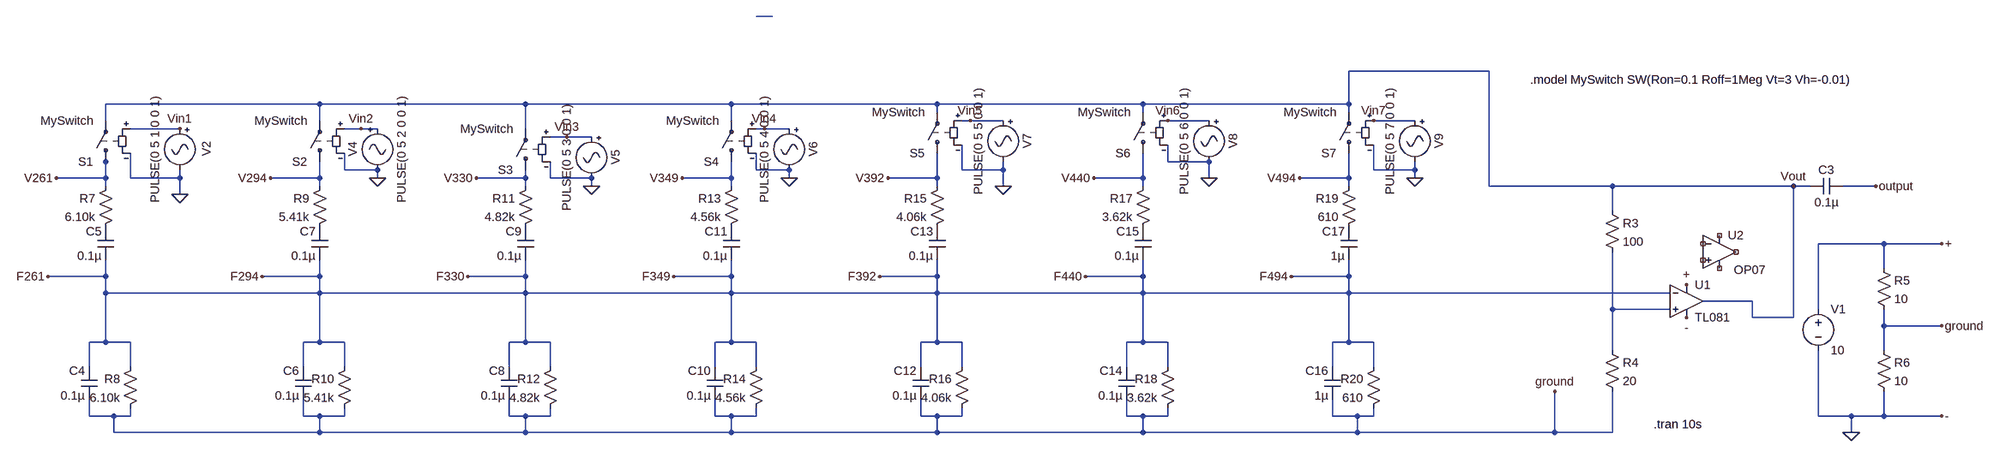
[diagram p0: schematic Sine_wave_oscilator_SW.asc]
Sine_wave_oscilator_SW.asc, the LTspice schematic file:
Version 4
SHEET 1 1532 724
WIRE -1376 -272 -1408 -272
WIRE 16 -160 -256 -160
WIRE -2256 -96 -2672 -96
WIRE -1856 -96 -2256 -96
WIRE -1456 -96 -1856 -96
WIRE -1056 -96 -1456 -96
WIRE -656 -96 -1056 -96
WIRE -256 -96 -256 -160
WIRE -256 -96 -656 -96
WIRE -1056 -80 -1056 -96
WIRE -656 -80 -656 -96
WIRE -256 -80 -256 -96
WIRE -2672 -64 -2672 -96
WIRE -2256 -64 -2256 -96
WIRE -1456 -64 -1456 -96
WIRE -992 -64 -1008 -64
WIRE -928 -64 -992 -64
WIRE -528 -64 -608 -64
WIRE -128 -64 -208 -64
WIRE -2528 -48 -2624 -48
WIRE -2176 -48 -2208 -48
WIRE -2144 -48 -2176 -48
WIRE -1856 -48 -1856 -96
WIRE -1392 -48 -1408 -48
WIRE -1344 -48 -1392 -48
WIRE -1776 -32 -1808 -32
WIRE -1728 -32 -1776 -32
WIRE -2672 16 -2672 0
WIRE -608 16 -608 -16
WIRE -528 16 -608 16
WIRE -2208 32 -2208 0
WIRE -2144 32 -2208 32
WIRE -1408 32 -1408 0
WIRE -1344 32 -1408 32
WIRE -1008 32 -1008 -16
WIRE -928 32 -928 16
WIRE -928 32 -1008 32
WIRE -208 32 -208 -16
WIRE -128 32 -128 16
WIRE -128 32 -208 32
WIRE -2672 48 -2672 16
WIRE -2672 48 -2768 48
WIRE -2624 48 -2624 0
WIRE -2528 48 -2528 32
WIRE -2528 48 -2624 48
WIRE -2256 48 -2256 16
WIRE -2256 48 -2352 48
WIRE -2144 48 -2144 32
WIRE -1856 48 -1856 32
WIRE -1856 48 -1952 48
WIRE -1808 48 -1808 16
WIRE -1728 48 -1808 48
WIRE -1456 48 -1456 16
WIRE -1456 48 -1552 48
WIRE -1344 48 -1344 32
WIRE -1056 48 -1056 0
WIRE -1056 48 -1152 48
WIRE -656 48 -656 0
WIRE -656 48 -752 48
WIRE -528 48 -528 16
WIRE -256 48 -256 0
WIRE -256 48 -352 48
WIRE -128 48 -128 32
WIRE -2672 64 -2672 48
WIRE -2256 64 -2256 48
WIRE -1856 64 -1856 48
WIRE -1728 64 -1728 48
WIRE -1456 64 -1456 48
WIRE -1056 64 -1056 48
WIRE -928 64 -928 32
WIRE -656 64 -656 48
WIRE -256 64 -256 48
WIRE 16 64 16 -160
WIRE 256 64 16 64
WIRE 608 64 256 64
WIRE 640 64 608 64
WIRE 768 64 704 64
WIRE -2528 80 -2528 48
WIRE 256 112 256 64
WIRE 784 176 656 176
WIRE 896 176 784 176
WIRE 784 224 784 176
WIRE -2672 240 -2672 208
WIRE -2672 240 -2784 240
WIRE -2256 240 -2256 208
WIRE -2256 240 -2368 240
WIRE -1856 240 -1856 208
WIRE -1856 240 -1968 240
WIRE -1456 240 -1456 208
WIRE -1456 240 -1568 240
WIRE -1056 240 -1056 208
WIRE -1056 240 -1168 240
WIRE -656 240 -656 208
WIRE -656 240 -768 240
WIRE -256 240 -256 208
WIRE -256 240 -368 240
WIRE -2672 272 -2672 240
WIRE -2256 272 -2256 240
WIRE -2256 272 -2672 272
WIRE -1856 272 -1856 240
WIRE -1856 272 -2256 272
WIRE -1456 272 -1456 240
WIRE -1456 272 -1856 272
WIRE -1056 272 -1056 240
WIRE -1056 272 -1456 272
WIRE -656 272 -656 240
WIRE -656 272 -1056 272
WIRE -256 272 -256 240
WIRE -256 272 -656 272
WIRE 368 272 -256 272
WIRE 528 288 432 288
WIRE 256 304 256 192
WIRE 368 304 256 304
WIRE 656 304 656 176
WIRE 528 320 528 288
WIRE 608 320 608 64
WIRE 608 320 528 320
WIRE 784 336 784 304
WIRE 896 336 784 336
WIRE -2672 368 -2672 272
WIRE -2672 368 -2704 368
WIRE -2624 368 -2672 368
WIRE -2256 368 -2256 272
WIRE -2256 368 -2288 368
WIRE -2208 368 -2256 368
WIRE -1856 368 -1856 272
WIRE -1856 368 -1888 368
WIRE -1808 368 -1856 368
WIRE -1456 368 -1456 272
WIRE -1456 368 -1488 368
WIRE -1408 368 -1456 368
WIRE -1056 368 -1056 272
WIRE -1056 368 -1088 368
WIRE -1008 368 -1056 368
WIRE -656 368 -656 272
WIRE -656 368 -688 368
WIRE -608 368 -656 368
WIRE -256 368 -256 272
WIRE -256 368 -288 368
WIRE -208 368 -256 368
WIRE 256 384 256 304
WIRE 784 384 784 336
WIRE -2704 416 -2704 368
WIRE -2624 416 -2624 368
WIRE -2288 416 -2288 368
WIRE -2208 416 -2208 368
WIRE -1888 416 -1888 368
WIRE -1808 416 -1808 368
WIRE -1488 416 -1488 368
WIRE -1408 416 -1408 368
WIRE -1088 416 -1088 368
WIRE -1008 416 -1008 368
WIRE -688 416 -688 368
WIRE -608 416 -608 368
WIRE -288 416 -288 368
WIRE -208 416 -208 368
WIRE -2704 512 -2704 480
WIRE -2656 512 -2704 512
WIRE -2624 512 -2624 496
WIRE -2624 512 -2656 512
WIRE -2288 512 -2288 480
WIRE -2256 512 -2288 512
WIRE -2208 512 -2208 496
WIRE -2208 512 -2256 512
WIRE -1888 512 -1888 480
WIRE -1856 512 -1888 512
WIRE -1808 512 -1808 496
WIRE -1808 512 -1856 512
WIRE -1488 512 -1488 480
WIRE -1456 512 -1488 512
WIRE -1408 512 -1408 496
WIRE -1408 512 -1456 512
WIRE -1088 512 -1088 480
WIRE -1056 512 -1088 512
WIRE -1008 512 -1008 496
WIRE -1008 512 -1056 512
WIRE -688 512 -688 480
WIRE -656 512 -688 512
WIRE -608 512 -608 496
WIRE -608 512 -656 512
WIRE -288 512 -288 480
WIRE -240 512 -288 512
WIRE -208 512 -208 496
WIRE -208 512 -240 512
WIRE 656 512 656 384
WIRE 720 512 656 512
WIRE 784 512 784 464
WIRE 784 512 720 512
WIRE 896 512 784 512
WIRE -2656 544 -2656 512
WIRE -2256 544 -2256 512
WIRE -2256 544 -2656 544
WIRE -1856 544 -1856 512
WIRE -1856 544 -2256 544
WIRE -1456 544 -1456 512
WIRE -1456 544 -1856 544
WIRE -1056 544 -1056 512
WIRE -1056 544 -1456 544
WIRE -656 544 -656 512
WIRE -656 544 -1056 544
WIRE -240 544 -240 512
WIRE -240 544 -656 544
WIRE 144 544 144 464
WIRE 144 544 -240 544
WIRE 256 544 256 464
WIRE 256 544 144 544
WIRE 720 544 720 512
FLAG 720 544 0
FLAG 896 176 +
FLAG 400 256 +
FLAG 896 336 ground
FLAG 144 464 ground
FLAG 896 512 -
FLAG 400 320 -
FLAG 768 64 output
FLAG 608 64 Vout
FLAG -2528 80 0
FLAG -2528 -48 Vin1
FLAG -2768 48 V261
FLAG -2784 240 F261
FLAG -2144 48 0
FLAG -2176 -48 Vin2
FLAG -2352 48 V294
FLAG -2368 240 F294
FLAG -1728 64 0
FLAG -1776 -32 Vin3
FLAG -1952 48 V330
FLAG -1968 240 F330
FLAG -1344 48 0
FLAG -1392 -48 Vin4
FLAG -1552 48 V349
FLAG -1568 240 F349
FLAG -992 -64 Vin5
FLAG -1152 48 V392
FLAG -1168 240 F392
FLAG -608 -64 Vin6
FLAG -752 48 V440
FLAG -768 240 F440
FLAG -128 48 0
FLAG -352 48 V494
FLAG -368 240 F494
FLAG -208 -64 Vin7
FLAG -528 48 0
FLAG -928 64 0
DATAFLAG 336 64 ""
SYMBOL res 240 96 R0
SYMATTR InstName R3
SYMATTR Value 100
SYMATTR SpiceLine tol=1 pwr=0.1
SYMBOL res 240 368 R0
SYMATTR InstName R4
SYMATTR Value 20
SYMATTR SpiceLine tol=1 pwr=0.1
SYMBOL voltage 656 288 R0
WINDOW 123 0 0 Left 0
WINDOW 39 0 0 Left 0
SYMATTR InstName V1
SYMATTR Value 10
SYMBOL res 768 208 R0
SYMATTR InstName R5
SYMATTR Value 10
SYMATTR SpiceLine tol=1 pwr=0.1
SYMBOL res 768 368 R0
SYMATTR InstName R6
SYMATTR Value 10
SYMATTR SpiceLine tol=1 pwr=0.1
SYMBOL cap 704 48 R90
WINDOW 0 0 32 VBottom 2
WINDOW 3 32 32 VTop 2
SYMATTR InstName C3
SYMATTR Value 0.1µ
SYMATTR SpiceLine V=6.3 Irms=25.7m Rser=3.62516 Lser=0
SYMBOL Misc\\signal -2528 -64 M0
WINDOW 0 -37 55 VBottom 2
WINDOW 3 32 56 VTop 2
WINDOW 123 0 0 Left 0
WINDOW 39 0 0 Left 0
SYMATTR InstName V2
SYMATTR Value PULSE(0 5 1 0 0 1)
SYMBOL res -2656 48 M0
SYMATTR InstName R7
SYMATTR Value 6.10k
SYMBOL res -2608 400 M0
SYMATTR InstName R8
SYMATTR Value 6.10k
SYMBOL cap -2688 416 M0
SYMATTR InstName C4
SYMATTR Value 0.1µ
SYMBOL cap -2656 144 M0
SYMATTR InstName C5
SYMATTR Value 0.1µ
SYMBOL Misc\\signal -2144 -64 R0
WINDOW 0 -32 56 VBottom 2
WINDOW 3 32 56 VTop 2
WINDOW 123 0 0 Left 0
WINDOW 39 0 0 Left 0
SYMATTR InstName V4
SYMATTR Value PULSE(0 5 2 0 0 1)
SYMBOL res -2240 48 M0
SYMATTR InstName R9
SYMATTR Value 5.41k
SYMBOL res -2192 400 M0
SYMATTR InstName R10
SYMATTR Value 5.41k
SYMBOL cap -2272 416 M0
SYMATTR InstName C6
SYMATTR Value 0.1µ
SYMBOL cap -2240 144 M0
SYMATTR InstName C7
SYMATTR Value 0.1µ
SYMBOL Misc\\signal -1728 -48 M0
WINDOW 0 -32 56 VBottom 2
WINDOW 3 32 56 VTop 2
WINDOW 123 0 0 Left 0
WINDOW 39 0 0 Left 0
SYMATTR InstName V5
SYMATTR Value PULSE(0 5 3 0 0 1)
SYMBOL res -1840 48 M0
SYMATTR InstName R11
SYMATTR Value 4.82k
SYMBOL res -1792 400 M0
SYMATTR InstName R12
SYMATTR Value 4.82k
SYMBOL cap -1872 416 M0
SYMATTR InstName C8
SYMATTR Value 0.1µ
SYMBOL cap -1840 144 M0
SYMATTR InstName C9
SYMATTR Value 0.1µ
SYMBOL Misc\\signal -1344 -64 M0
WINDOW 0 -32 56 VBottom 2
WINDOW 3 32 56 VTop 2
WINDOW 123 0 0 Left 0
WINDOW 39 0 0 Left 0
SYMATTR InstName V6
SYMATTR Value PULSE(0 5 4 0 0 1)
SYMBOL res -1440 48 M0
SYMATTR InstName R13
SYMATTR Value 4.56k
SYMBOL res -1392 400 M0
SYMATTR InstName R14
SYMATTR Value 4.56k
SYMBOL cap -1472 416 M0
SYMATTR InstName C10
SYMATTR Value 0.1µ
SYMBOL cap -1440 144 M0
SYMATTR InstName C11
SYMATTR Value 0.1µ
SYMBOL Misc\\signal -928 -80 M0
WINDOW 0 -32 56 VBottom 2
WINDOW 3 32 56 VTop 2
WINDOW 123 0 0 Left 0
WINDOW 39 0 0 Left 0
SYMATTR InstName V7
SYMATTR Value PULSE(0 5 5 0 0 1)
SYMBOL res -1040 48 M0
SYMATTR InstName R15
SYMATTR Value 4.06k
SYMBOL res -992 400 M0
SYMATTR InstName R16
SYMATTR Value 4.06k
SYMBOL cap -1072 416 M0
SYMATTR InstName C12
SYMATTR Value 0.1µ
SYMBOL cap -1040 144 M0
SYMATTR InstName C13
SYMATTR Value 0.1µ
SYMBOL Misc\\signal -528 -80 M0
WINDOW 0 -32 56 VBottom 2
WINDOW 3 32 56 VTop 2
WINDOW 123 0 0 Left 0
WINDOW 39 0 0 Left 0
SYMATTR InstName V8
SYMATTR Value PULSE(0 5 6 0 0 1)
SYMBOL res -640 48 M0
SYMATTR InstName R17
SYMATTR Value 3.62k
SYMBOL res -592 400 M0
SYMATTR InstName R18
SYMATTR Value 3.62k
SYMBOL cap -672 416 M0
SYMATTR InstName C14
SYMATTR Value 0.1µ
SYMBOL cap -640 144 M0
SYMATTR InstName C15
SYMATTR Value 0.1µ
SYMBOL Misc\\signal -128 -80 M0
WINDOW 0 -32 56 VBottom 2
WINDOW 3 32 56 VTop 2
WINDOW 123 0 0 Left 0
WINDOW 39 0 0 Left 0
SYMATTR InstName V9
SYMATTR Value PULSE(0 5 7 0 0 1)
SYMBOL res -240 48 M0
SYMATTR InstName R19
SYMATTR Value 610
SYMBOL res -192 400 M0
SYMATTR InstName R20
SYMATTR Value 610
SYMBOL cap -272 416 M0
SYMATTR InstName C16
SYMATTR Value 1µ
SYMBOL cap -240 144 M0
SYMATTR InstName C17
SYMATTR Value 1µ
SYMBOL AutoGenerated\\TL081 400 224 R0
SYMATTR InstName U1
SYMBOL Opamps\\OP07 464 128 R0
WINDOW 3 28 99 Left 2
SYMATTR InstName U2
SYMBOL sw -2672 32 R180
SYMATTR InstName S1
SYMATTR Value MySwitch
SYMBOL sw -2256 32 R180
SYMATTR InstName S2
SYMATTR Value MySwitch
SYMBOL sw -1856 48 R180
SYMATTR InstName S3
SYMATTR Value MySwitch
SYMBOL sw -1456 32 R180
SYMATTR InstName S4
SYMATTR Value MySwitch
SYMBOL sw -1056 16 R180
SYMATTR InstName S5
SYMATTR Value MySwitch
SYMBOL sw -656 16 R180
SYMATTR InstName S6
SYMATTR Value MySwitch
SYMBOL sw -256 16 R180
SYMATTR InstName S7
SYMATTR Value MySwitch
TEXT 336 528 Left 2 !.tran 10s
TEXT 96 -144 Left 2 !.model MySwitch SW(Ron=0.1 Roff=1Meg Vt=3 Vh=-0.01)

The netlist it stands for:
* Sine_wave_oscilator_SW.asc
R3 Vout N002 100 tol=1 pwr=0.1
R4 N002 ground 20 tol=1 pwr=0.1
V1 + 0 10
R5 + ground 10 tol=1 pwr=0.1
R6 ground 0 10 tol=1 pwr=0.1
C3 output Vout 0.1µ V=6.3 Irms=25.7m Rser=3.62516 Lser=0
V2 Vin1 0 PULSE(0 5 1 0 0 1)
R7 V261 P001 6.10k
R8 F494 ground 6.10k
C4 F494 ground 0.1µ
C5 P001 F494 0.1µ
V4 Vin2 0 PULSE(0 5 2 0 0 1)
R9 V294 P002 5.41k
R10 F494 ground 5.41k
C6 F494 ground 0.1µ
C7 P002 F494 0.1µ
V5 Vin3 0 PULSE(0 5 3 0 0 1)
R11 V330 P003 4.82k
R12 F494 ground 4.82k
C8 F494 ground 0.1µ
C9 P003 F494 0.1µ
V6 Vin4 0 PULSE(0 5 4 0 0 1)
R13 V349 P004 4.56k
R14 F494 ground 4.56k
C10 F494 ground 0.1µ
C11 P004 F494 0.1µ
V7 Vin5 0 PULSE(0 5 5 0 0 1)
R15 V392 P005 4.06k
R16 F494 ground 4.06k
C12 F494 ground 0.1µ
C13 P005 F494 0.1µ
V8 Vin6 0 PULSE(0 5 6 0 0 1)
R17 V440 P006 3.62k
R18 F494 ground 3.62k
C14 F494 ground 0.1µ
C15 P006 F494 0.1µ
V9 Vin7 0 PULSE(0 5 7 0 0 1)
R19 V494 P007 610
R20 F494 ground 610
C16 F494 ground 1µ
C17 P007 F494 1µ
* U1: TL081 (symbol AutoGenerated\TL081 not available, pins judged from their places): In+=N002 In-=F494 V+=+ V-=0 OUT=Vout
XU2 NC_01 NC_02 NC_03 NC_04 NC_05 LT1001  ; OP07, pins In+ In- V+ V- OUT
S1 V261 Vout Vin1 0 MySwitch
S2 V294 Vout Vin2 0 MySwitch
S3 V330 Vout Vin3 0 MySwitch
S4 V349 Vout Vin4 0 MySwitch
S5 V392 Vout Vin5 0 MySwitch
S6 V440 Vout Vin6 0 MySwitch
S7 V494 Vout Vin7 0 MySwitch
.tran 10s
.model MySwitch SW(Ron=0.1 Roff=1Meg Vt=3 Vh=-0.01)
.lib LTC.lib
.backanno
.end